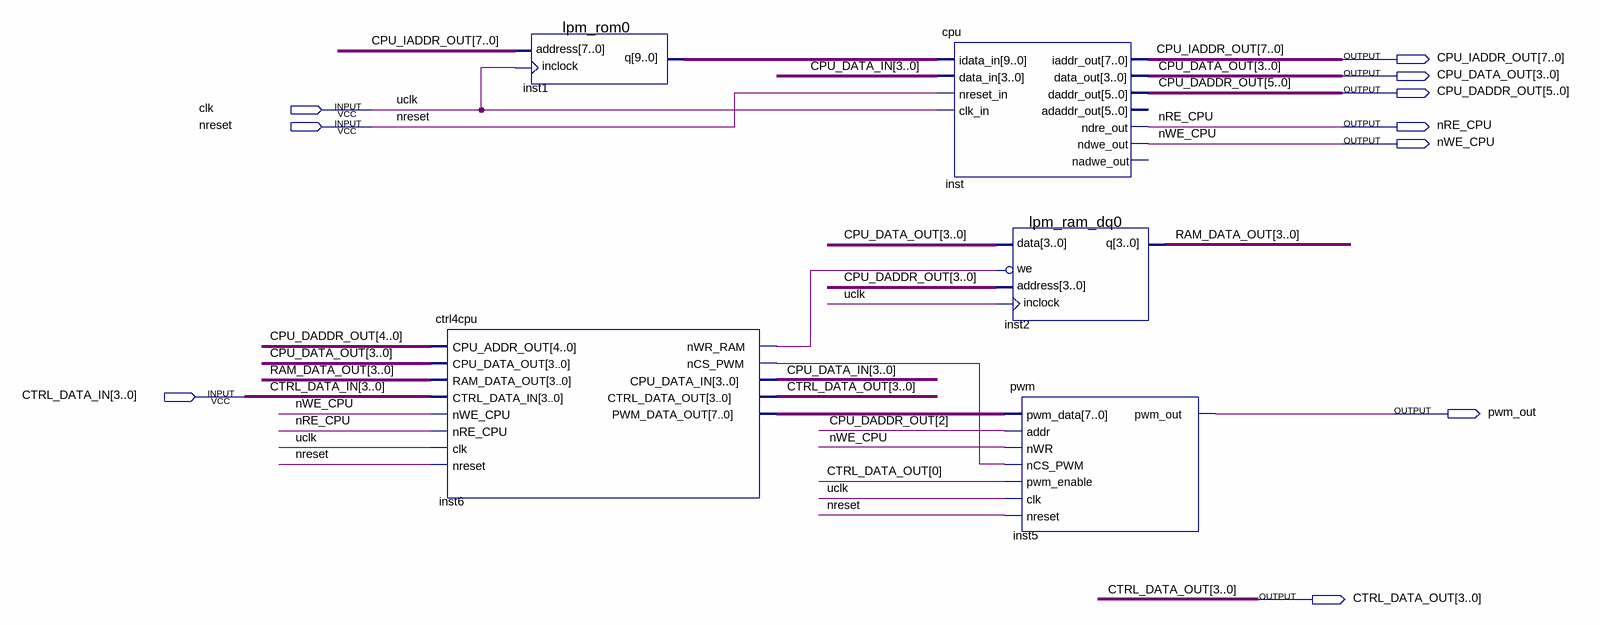
[diagram p0: schematic sheet]
// Quartus schematic cpu4bit.bdf as structural Verilog: 5 symbols, 10 pins
module cpu4bit (
  input  clk,
  input  nreset,
  input  [3:0] CTRL_DATA_IN,
  output [7:0] CPU_IADDR_OUT,
  output [3:0] CPU_DATA_OUT,
  output [5:0] CPU_DADDR_OUT,
  output nRE_CPU,
  output nWE_CPU,
  output pwm_out,
  output [3:0] CTRL_DATA_OUT
);

  wire inst6_ncs_pwm, inst6_nwr_ram;
  wire [3:0] CPU_DATA_IN, RAM_DATA_OUT;
  wire [7:0] inst6_pwm_data_out;
  wire [9:0] inst1_q;

  ctrl4cpu inst6 (
    .CPU_ADDR_OUT(CPU_DADDR_OUT[4:0]), .CPU_DATA_OUT(CPU_DATA_OUT), .RAM_DATA_OUT(RAM_DATA_OUT),
    .CTRL_DATA_IN(CTRL_DATA_IN), .nWE_CPU(nWE_CPU), .nRE_CPU(nRE_CPU), .clk(clk), .nreset(nreset),
    .nWR_RAM(inst6_nwr_ram), .nCS_PWM(inst6_ncs_pwm), .CPU_DATA_IN(CPU_DATA_IN),
    .CTRL_DATA_OUT(CTRL_DATA_OUT), .PWM_DATA_OUT(inst6_pwm_data_out));
  lpm_rom0 inst1 (.address(CPU_IADDR_OUT), .inclock(clk), .q(inst1_q));
  cpu inst (
    .idata_in(inst1_q), .data_in(CPU_DATA_IN), .nreset_in(nreset), .clk_in(clk), .iaddr_out(CPU_IADDR_OUT),
    .data_out(CPU_DATA_OUT), .daddr_out(CPU_DADDR_OUT), .ndre_out(nRE_CPU), .ndwe_out(nWE_CPU));  // open: adaddr_out, nadwe_out
  lpm_ram_dq0 inst2 (
    .data(CPU_DATA_OUT), .we(~inst6_nwr_ram), .address(CPU_DADDR_OUT[3:0]), .inclock(clk), .q(RAM_DATA_OUT));
  pwm inst5 (
    .pwm_data(inst6_pwm_data_out), .addr(CPU_DADDR_OUT[2]), .nWR(nWE_CPU), .nCS_PWM(inst6_ncs_pwm),
    .pwm_enable(CTRL_DATA_OUT[0]), .clk(clk), .nreset(nreset), .pwm_out(pwm_out));

  // Other names for the same wires on the sheet: uclk = clk
endmodule
